# EasyEDA Pro project custom PCB June 25 2024.eprj

# Schematic Schematic1
Create Date: 2023-01-16; Page Name: P1; Project Name: Mine7; Schematic Name: Schematic1; Update Date: 2024-06-25; Company: AG6NS  Kazu Terasaki; Drawed: EasyEDA Pro; Page Size: A3; Part Number: JLCPCB-001; Reviewed: EasyEDA Pro; Version: 2023.09.11
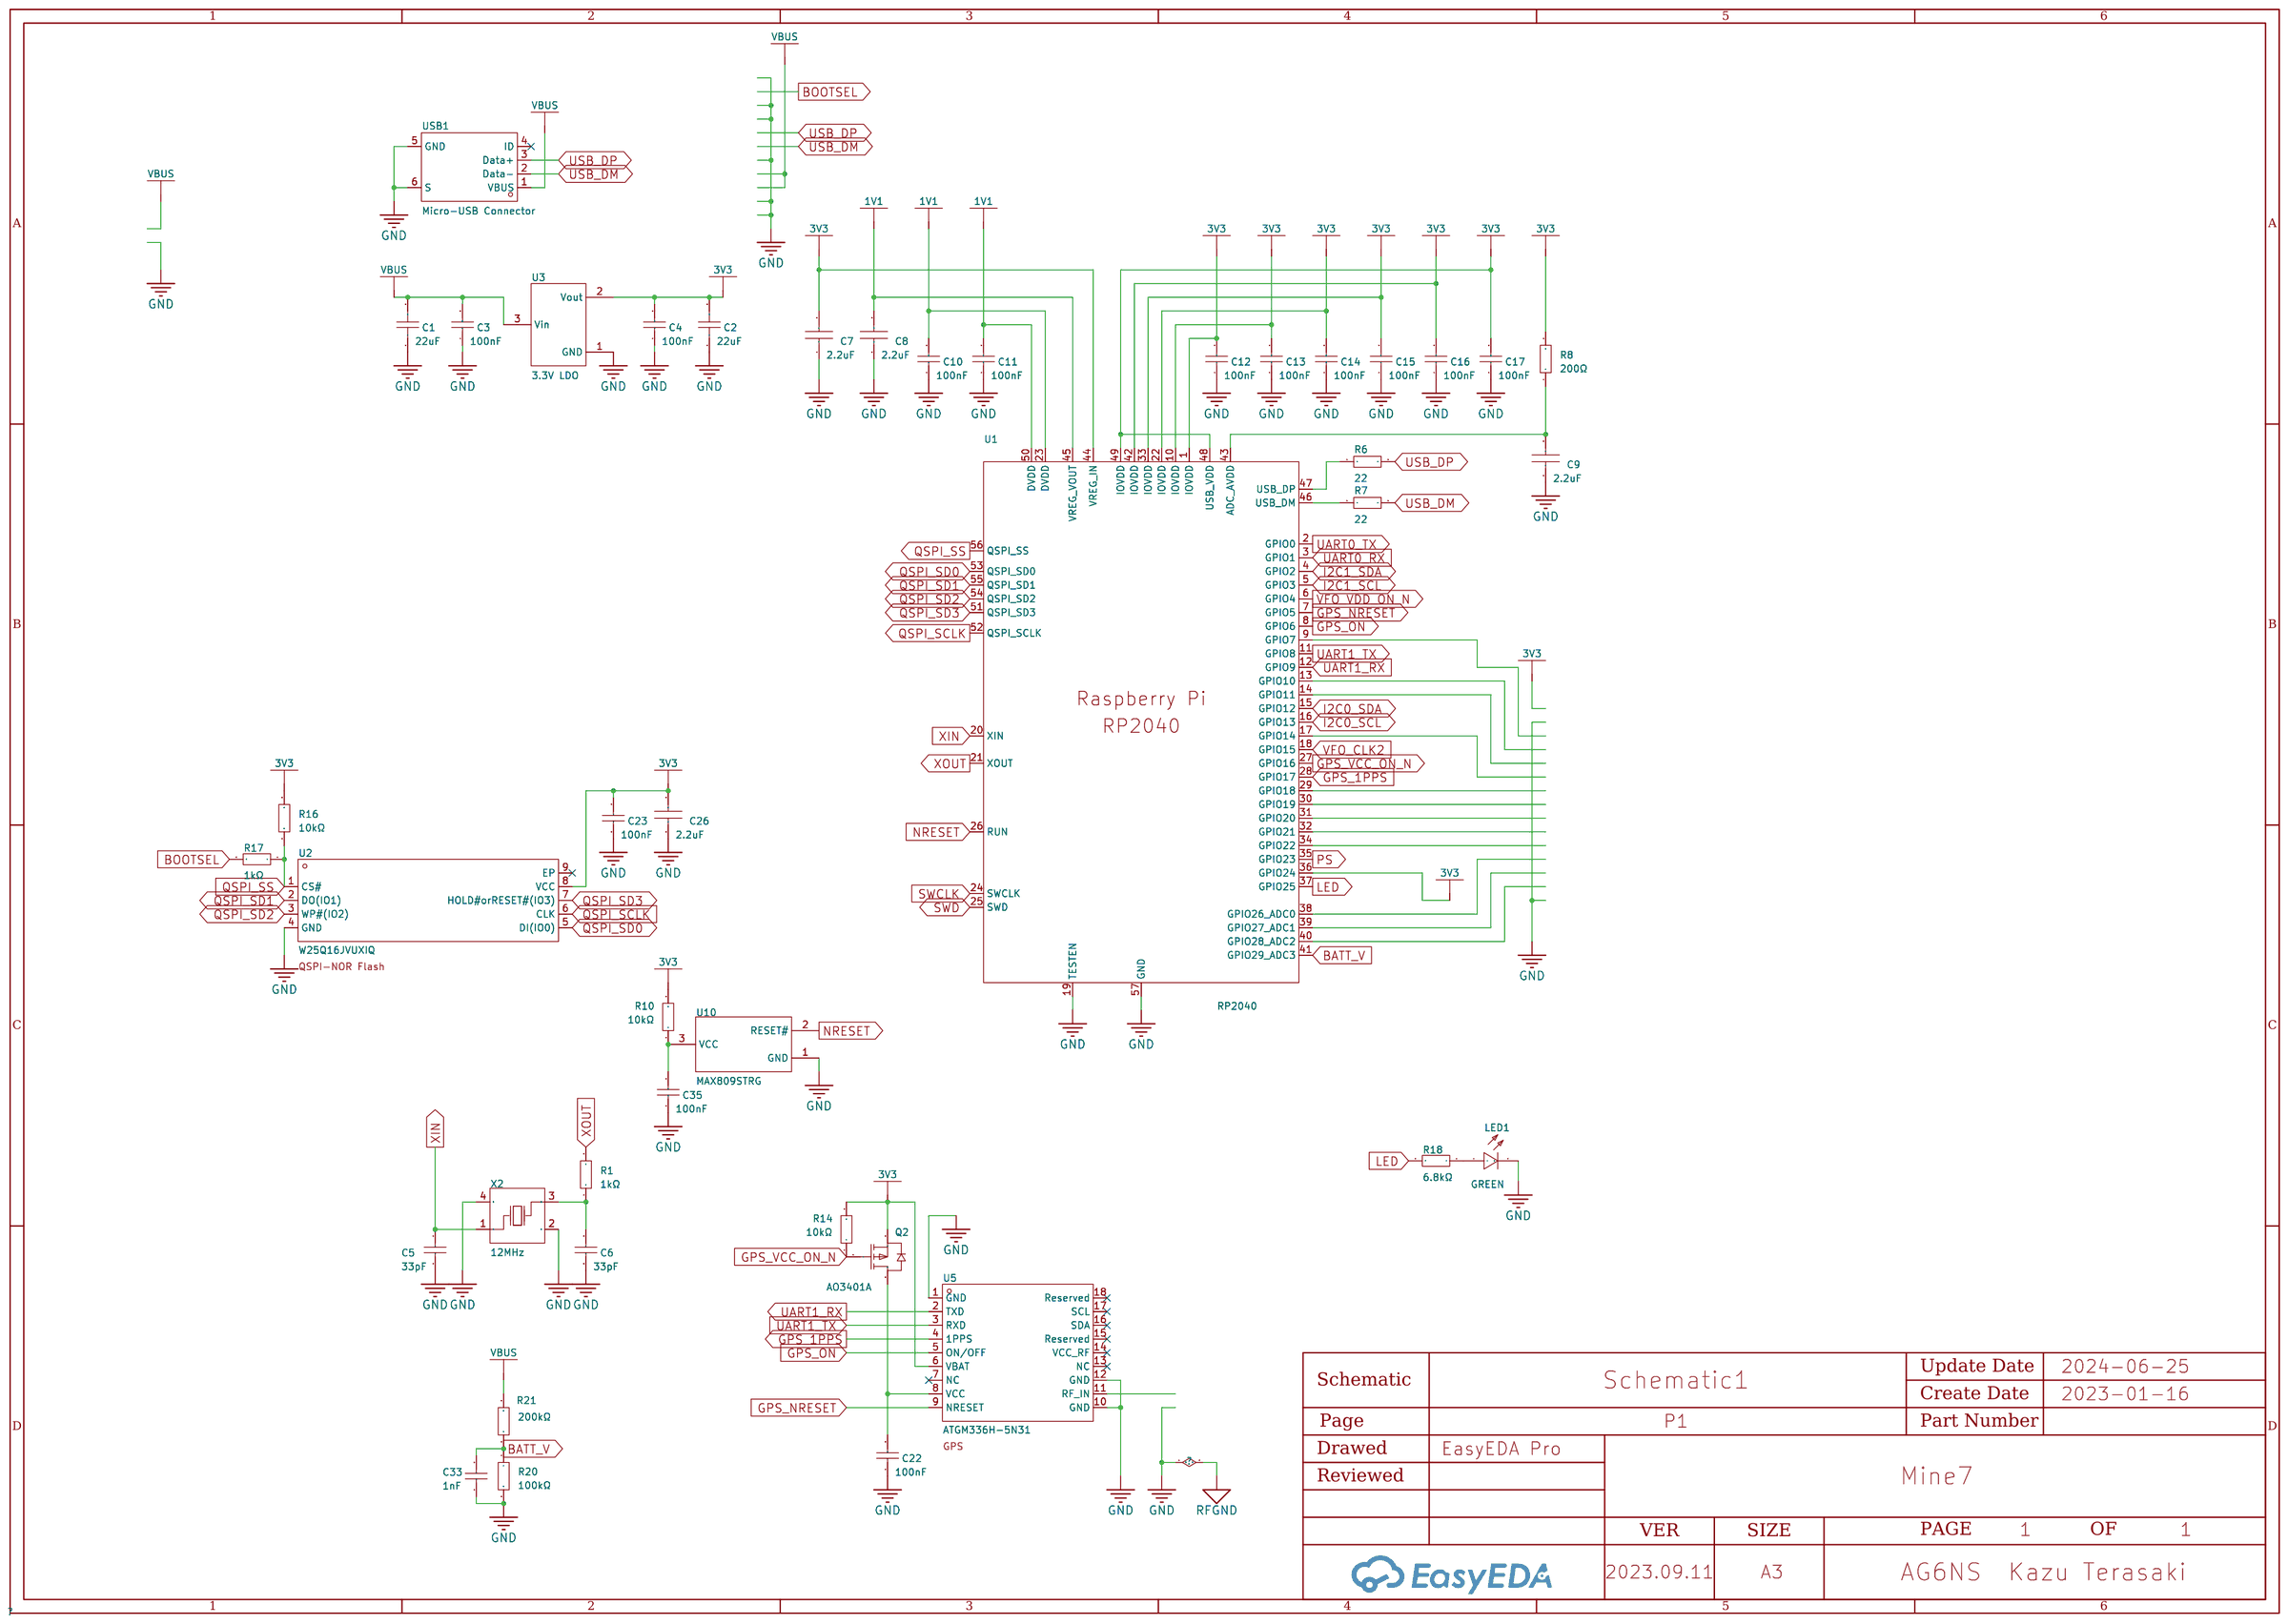
[diagram p0: schematic sheet]

## Parts
C1  22uF  [C0805]
C2  22uF  [C0603]
C3  100nF  [C0402_NEW]
C4  100nF  [C0402_NEW]
C5  33pF  [C0402]
C6  33pF  [C0402]
C7  2.2uF  [C0402]
C8  2.2uF  [C0402]
C9  2.2uF  [C0402]
C10  100nF  [C0402_NEW]
C11  100nF  [C0402_NEW]
C12  100nF  [C0402_NEW]
C13  100nF  [C0402_NEW]
C14  100nF  [C0402_NEW]
C15  100nF  [C0402_NEW]
C16  100nF  [C0402_NEW]
C17  100nF  [C0402_NEW]
C22  100nF  [C0402_NEW]
C23  100nF  [C0402_NEW]
C26  2.2uF  [C0402]
C33  1nF  [C0402]
C35  100nF  [C0402_NEW]
LED1  GREEN  [LED0603-R-RD]
Q2  AO3401A  [SOT-23_L2.9-W1.3-P1.90-LS2.4-BR]
R1  1kΩ  [R0402]
R6  22  [R0402]
R7  22  [R0402]
R8  200Ω  [R0402]
R10  10kΩ  [R0402]
R14  10kΩ  [R0402]
R16  10kΩ  [R0402]
R17  1kΩ  [R0402]
R18  6.8kΩ  [R0402]
R20  100kΩ  [R0402]
R21  200kΩ  [R0402]
U1  RP2040  [LQFN-56_L7.0-W7.0-P0.4-EP]
U2  W25Q16JVUXIQ  [USON-8_L3.0-W2.0-P0.50-BL-EP]
U3  3.3V LDO  [SOT-23-3_L2.9-W1.6-P1.90-LS2.8-BR]
U5  ATGM336H-5N31  [GPSM-SMD_ATGM336H-TR]
U10  MAX809STRG  [SOT-23-3_L2.9-W1.6-P1.90-LS2.8-BR]
USB1  Micro-USB Connector  [MICRO-USB-SMD_10118194-0001LF]
X2  12MHz  [OSC-SMD_4P-L3.2-W2.5-BL]

## Library data of the parts
C1 = CL21A226MAQNNNE_C45783: Capacitance: Tolerance:±20% Tolerance:±20% Voltage Rated: Temperature Coefficient:; LCSC Part Name: 22uF ±20% 25V; Supplier Part: C45783; Manufacturer: SAMSUNG(三星); Manufacturer Part: CL21A226MAQNNNE; Supplier Footprint: 0805; JLCPCB Part Class: Basic Part; Datasheet: https://atta.szlcsc.com/upload/public/pdf/source/20160103/1457707727161.pdf; Supplier: LCSC; Tolerance: ±20%
C2 = CL10A226MQ8NRNC: Capacitance: Tolerance:±20% Tolerance:±20% Voltage Rated: Temperature Coefficient:; LCSC Part Name: 22uF ±20% 6.3V; Supplier Part: C59461; Manufacturer: SAMSUNG(三星); Supplier Footprint: 0603; JLCPCB Part Class: Basic Part; Datasheet: https://atta.szlcsc.com/upload/public/pdf/source/20160103/1457707740762.pdf; Supplier: LCSC; Tolerance: ±20%
C3 C4 C10-C17 C22 C23 C35 = CL05B104KO5NNNC: Capacitance: Tolerance:±10% Tolerance:±10% Voltage Rated: Temperature Coefficient:; LCSC Part Name: 100nF ±10% 16V; Supplier Part: C1525; Manufacturer: SAMSUNG(三星); Supplier Footprint: 0402; JLCPCB Part Class: Basic Part; Datasheet: https://atta.szlcsc.com/upload/public/pdf/source/20160103/1457707674891.pdf; Supplier: LCSC; Tolerance: ±10%
C5 C6 = 0402CG330J500NT: Capacitance: Tolerance:±5% Tolerance:±5% Voltage Rated: Temperature Coefficient:; LCSC Part Name: 33pF ±5% 50V; Supplier Part: C1562; Manufacturer: FH(风华); Supplier Footprint: 0402; JLCPCB Part Class: Basic Part; Datasheet: https://atta.szlcsc.com/upload/public/pdf/source/20170923/C1562_1506149272462988369.pdf; Supplier: LCSC; Tolerance: ±5%
C7-C9 C26 = CL05A225MQ5NSNC: Capacitance: Tolerance:±20% Tolerance:±20% Voltage Rated: Temperature Coefficient:; LCSC Part Name: 2.2uF ±20% 6.3V; Supplier Part: C12530; Manufacturer: SAMSUNG(三星); Supplier Footprint: 0402; JLCPCB Part Class: Basic Part; Datasheet: https://atta.szlcsc.com/upload/public/pdf/source/20160103/1457707666860.pdf; Supplier: LCSC; Tolerance: ±20%
C33 = 0402B102K500NT: Capacitance: Tolerance:±10% Tolerance:±10% Voltage Rated: Temperature Coefficient:; LCSC Part Name: 1nF ±10% 50V; Supplier Part: C1523; Manufacturer: FH(风华); Supplier Footprint: 0402; JLCPCB Part Class: Basic Part; Datasheet: https://atta.szlcsc.com/upload/public/pdf/source/20170923/C1523_1506149254821988331.pdf; Supplier: LCSC; Tolerance: ±10%
LED1 = 19-217/GHC-YR1S2/3T: Emitted Color:Emerald Diode Configuration:- Lens Color:Colorless transparence Dominant Wavelength:520nm~535nm Dominant Wavelength:520nm~535nm Peak Wavelength:518nm Color Temperature:- Color Temperature:- Forward Current:20mA Power Dissipation:110mW Viewin; LCSC Part Name: 翠绿 520nm~535nm; Supplier Part: C72043; Manufacturer: EVERLIGHT(亿光); Supplier Footprint: 0603; JLCPCB Part Class: Basic Part; Datasheet: https://atta.szlcsc.com/upload/public/pdf/source/20160507/1462613613780.pdf; Supplier: LCSC; Emitted Color: Emerald; Lens Color: Colorless transparence; Dominant Wavelength: 520nm~535nm; Peak Wavelength: 518nm; Forward Current: 20mA; Power Dissipation: 110mW; Viewing Angle: 120°; Operating Temperature: -40~+85
Q2 = AO3401A_C15127: Type: Drain Source Voltage (Vdss): Continuous Drain Current (Id): Power Dissipation (Pd): Drain Source On Resistance (RDS(on)@Vgs,Id):44mΩ@10V,4.3A Gate Threshold Voltage (Vgs(th)@Id):1.3V@250uA; LCSC Part Name: P沟道 30V 4A; Supplier Part: C15127; Manufacturer: AOS; Supplier Footprint: SOT-23; JLCPCB Part Class: Basic Part; Datasheet: https://atta.szlcsc.com/upload/public/pdf/source/20160507/1462613609053.pdf; Supplier: LCSC; Drain Source On Resistance (RDS(on)@Vgs,Id): 44mΩ@10V,4.3A; Gate Threshold Voltage (Vgs(th)@Id): 1.3V@250uA
R1 R17 = 0402WGF1001TCE: Type:Thick Film Resistors Resistance: Tolerance:±1% Tolerance:±1% Power(Watts): Temperature Coefficient:±100ppm/ Temperature Coefficient:±100ppm/ Overload Voltage (Max): Operating Temperature Range:-55~+155 Operating Temperature Range:-55~+155; LCSC Part Name: 1kΩ ±1% 62.5mW; Supplier Part: C11702; Manufacturer: UNI-ROYAL(厚声); Supplier Footprint: 0402; JLCPCB Part Class: Basic Part; Datasheet: https://atta.szlcsc.com/upload/public/pdf/source/20200306/C422600_1E6D84923E4A46A82E41ADD87F860B5C.pdf; Supplier: LCSC; Type: Thick Film Resistors; Tolerance: ±1%; Temperature Coefficient: ±100ppm/; Operating Temperature Range: -55~+155
R6 R7 = 0402WGF220JTCE: LCSC Part Name: 22Ω(22R0) ±1% 编带; Supplier Part: C25092; Manufacturer: UNI-ROYAL(厚声); Supplier Footprint: 0402; JLCPCB Part Class: Basic Part; Datasheet: https://atta.szlcsc.com/upload/public/pdf/source/20170920/C25092_1505901206069982723.pdf; Supplier: LCSC
R8 = 0402WGF2000TCE: Type:Thick Film Resistors Resistance: Tolerance:±1% Tolerance:±1% Power(Watts): Temperature Coefficient:±100ppm/ Temperature Coefficient:±100ppm/ Overload Voltage (Max): Operating Temperature Range:-55~+155 Operating Temperature Range:-55~+155; LCSC Part Name: 200Ω ±1% 62.5mW; Supplier Part: C25087; Manufacturer: UNI-ROYAL(厚声); Supplier Footprint: 0402; JLCPCB Part Class: Basic Part; Datasheet: https://atta.szlcsc.com/upload/public/pdf/source/20200306/C422600_1E6D84923E4A46A82E41ADD87F860B5C.pdf; Supplier: LCSC; Type: Thick Film Resistors; Tolerance: ±1%; Temperature Coefficient: ±100ppm/; Operating Temperature Range: -55~+155
R10 R14 R16 = 0402WGF1002TCE: Type:Thick Film Resistors Resistance: Tolerance:±1% Tolerance:±1% Power(Watts): Temperature Coefficient:±100ppm/ Temperature Coefficient:±100ppm/ Overload Voltage (Max): Operating Temperature Range:-55~+155 Operating Temperature Range:-55~+155; LCSC Part Name: 10kΩ ±1% 62.5mW; Supplier Part: C25744; Manufacturer: UNI-ROYAL(厚声); Supplier Footprint: 0402; JLCPCB Part Class: Basic Part; Datasheet: https://atta.szlcsc.com/upload/public/pdf/source/20200306/C422600_1E6D84923E4A46A82E41ADD87F860B5C.pdf; Supplier: LCSC; Type: Thick Film Resistors; Tolerance: ±1%; Temperature Coefficient: ±100ppm/; Operating Temperature Range: -55~+155
R18 = 0402WGF6801TCE: Type:Thick Film Resistors Resistance: Tolerance:±1% Tolerance:±1% Power(Watts): Temperature Coefficient:±100ppm/ Temperature Coefficient:±100ppm/ Overload Voltage (Max): Operating Temperature Range:-55~+155 Operating Temperature Range:-55~+155; LCSC Part Name: 6.8kΩ ±1% 62.5mW; Supplier Part: C25917; Manufacturer: UNI-ROYAL(厚声); Supplier Footprint: 0402; JLCPCB Part Class: Basic Part; Datasheet: https://atta.szlcsc.com/upload/public/pdf/source/20200306/C422600_1E6D84923E4A46A82E41ADD87F860B5C.pdf; Supplier: LCSC; Type: Thick Film Resistors; Tolerance: ±1%; Temperature Coefficient: ±100ppm/; Operating Temperature Range: -55~+155
R20 = 0402WGF1003TCE: Type:Thick Film Resistors Resistance: Tolerance:±1% Tolerance:±1% Power(Watts): Temperature Coefficient:±100ppm/ Temperature Coefficient:±100ppm/ Overload Voltage (Max): Operating Temperature Range:-55~+155 Operating Temperature Range:-55~+155; LCSC Part Name: 100kΩ ±1% 62.5mW; Supplier Part: C25741; Manufacturer: UNI-ROYAL(厚声); Supplier Footprint: 0402; JLCPCB Part Class: Basic Part; Datasheet: https://atta.szlcsc.com/upload/public/pdf/source/20200306/C422600_1E6D84923E4A46A82E41ADD87F860B5C.pdf; Supplier: LCSC; Type: Thick Film Resistors; Tolerance: ±1%; Temperature Coefficient: ±100ppm/; Operating Temperature Range: -55~+155
R21 = 0402WGF2003TCE: Resistance: Tolerance: Power(Watts): Temperature Coefficient: Temperature Coefficient: Overload Voltage (Max): Operating Temperature Range: Operating Temperature Range:; LCSC Part Name: 200KΩ ±1%; Supplier Part: C25764; Manufacturer: UNI-ROYAL(厚声); Supplier Footprint: 0402; JLCPCB Part Class: Basic Part; Datasheet: https://atta.szlcsc.com/upload/public/pdf/source/20170920/C25764_1505901532268983339.pdf; Supplier: LCSC
U1 = RP2040_C2040: CPU Core:ARM Cortex-M0 Maximum Frequency:133MHz Supply Voltage Range:- Supply Voltage Range:- Internal Oscillator:- External Clock Frequency Rang:- External Clock Frequency Rang:- Program FLASH Size:- RAM Size:264KB EEPROM/Data FLASH Size:- GPIO Ports Num; LCSC Part Name: ARM Cortex-M0 133MHz RAM：264KB; Supplier Part: C2040; Manufacturer: Raspberry Pi(树莓派); Supplier Footprint: LQFN-56(7x7); JLCPCB Part Class: Extended Part; Datasheet: https://atta.szlcsc.com/upload/public/pdf/source/20210621/C2040_96F425825606B7957D87DD32E2512CA9.pdf; Supplier: LCSC; CPU Core: ARM Cortex-M0; Maximum Frequency: 133MHz; RAM Size: 264KB; GPIO Ports Number: 30; ADC (Units/Channels/bits): 1@x4ch/12bit; U(S)ART Number: 2; I2C Number: 2; (Q)SPI Number: 2; USB (H/D/OTG): USB Host/Device; Peripherals / Functions / Protocol Stacks: DMA；PWM
U2 = W25Q16JVUXIQ: QSPI-NOR Flash; Supplier Part: C2843335; Manufacturer: WINBOND(华邦); Supplier Footprint: USON-8; JLCPCB Part Class: Extended Part; Datasheet: https://atta.szlcsc.com/upload/public/pdf/source/20210629/C2843335_FB4D78B5076715625DC0C83F790D3044.pdf; Supplier: LCSC
U3 = XC6206P332MR_C5446: Output Type: Output Polarity:Positive Number of Outputs:1 Maximum Input Voltage:6V Output Voltage:3.3V~3.3V Output Voltage:3.3V~3.3V Dropout Voltage:680mV@(100mA) Output Current:200mA Power Supply Rejection Ratio (PSRR):-; LCSC Part Name: 正 Vin=6V Vout=3.3V 200mA; Supplier Part: C5446; Manufacturer: TOREX(特瑞仕); Manufacturer Part: XC6206P332MR; Supplier Footprint: SOT-23; JLCPCB Part Class: Basic Part; Datasheet: https://atta.szlcsc.com/upload/public/pdf/source/20130801/1457706628791.pdf; Supplier: LCSC; Output Polarity: Positive; Number of Outputs: 1; Maximum Input Voltage: 6V; Output Voltage: 3.3V~3.3V; Dropout Voltage: 680mV@(100mA); Output Current: 200mA
U5 = ATGM336H-5N31: GPS; Supplier Part: C90770; Manufacturer: 杭州中科微; Supplier Footprint: 9.7x10.1mm; JLCPCB Part Class: Extended Part; Datasheet: https://atta.szlcsc.com/upload/public/pdf/source/20161226/1482720799860.pdf; Supplier: LCSC
U10 = MAX809STRG: Output Type:推挽 Reset Active Level:低电平有效 Number of Voltages Monitored:1 Threshold Voltage:2.93V Reset Timeout:140ms Operating Temperature:-40~+105@(TJ) Operating Temperature:-40~+105@(TJ) Type of the Power Management Chip:Simple reset/Power-on reset; LCSC Part Name: Voltage Supervisor, Very Low Supply Current, 3-Pin Microprocessor, Reset Monitor; Supplier Part: C9965; Manufacturer: onsemi(安森美); Supplier Footprint: SOT-23; JLCPCB Part Class: Extended Part; Datasheet: https://atta.szlcsc.com/upload/public/pdf/source/20170918/C9965_1505727085373976535.PDF; Supplier: LCSC; Output Type: 推挽; Reset Active Level: 低电平有效; Number of Voltages Monitored: 1; Threshold Voltage: 2.93V; Reset Timeout: 140ms; Operating Temperature: -40~+105@(TJ); Type of the Power Management Chip: Simple reset/Power-on reset
USB1 = 10118194-0001LF: Connector Type:Micro-B Standard:USB 2.0 Gender:Female Number of Contacts:5 Number of Ports:1; LCSC Part Name: Micro-B 母座; Supplier Part: C132563; Manufacturer: Amphenol; Supplier Footprint: SMD; JLCPCB Part Class: Extended Part; Datasheet: https://atta.szlcsc.com/upload/public/pdf/source/20210630/C132563_323781699BE9D7BFAD8DF70EA5820798.pdf; Supplier: LCSC; Connector Type: Micro-B; Standard: USB 2.0; Gender: Female; Number of Contacts: 5; Number of Ports: 1
X2 = X322512MSB4SI: Crystal Type:SMD Crystal Resonator Frequency: Frequency Tolerance:±10ppm Frequency Tolerance:±10ppm Frequency Stability:±30ppm Frequency Stability:±30ppm Load Capacitance: Operating Temperature: Operating Temperature:; LCSC Part Name: 12MHz ±10ppm 20pF; Supplier Part: C9002; Manufacturer: YXC(扬兴晶振); Supplier Footprint: SMD3225-4P; JLCPCB Part Class: Basic Part; Datasheet: https://atta.szlcsc.com/upload/public/pdf/source/20210329/C112971_1F611BDC486E193C1706F6D8EB5AA189.pdf; Supplier: LCSC; Crystal Type: SMD Crystal Resonator; Frequency Tolerance: ±10ppm; Frequency Stability: ±30ppm

## Nets
1V1: C8.2 C10.2 C11.2 U1.23(DVDD) U1.45(VREG_VOUT) U1.50(DVDD)
3V3: C2.2 C4.2 C7.2 C12.2 C13.2 C14.2 C15.2 C16.2 C17.2 C23.2 C26.2 Q2.2(S) R8.2 R10.2 R14.2 R16.2 U1.1(IOVDD) U1.10(IOVDD) U1.22(IOVDD) U1.33(IOVDD) U1.36(GPIO24) U1.42(IOVDD) U1.44(VREG_IN) U1.48(USB_VDD) U1.49(IOVDD) U2.8(VCC) U3.2(Vout) U5.6(VBAT)
GND: C1.1 C2.1 C3.1 C4.1 C5.1 C6.1 C7.1 C8.1 C9.1 C10.1 C11.1 C12.1 C13.1 C14.1 C15.1 C16.1 C17.1 C22.1 C23.1 C26.1 C33.1 C35.1 LED1.2(C) R20.2 U1.19(TESTEN) U1.57(GND) U2.4(GND) U3.1(GND) U5.1(GND) U5.10(GND) U5.12(GND) U10.1(GND) USB1.5(GND) USB1.6(S) X2.2(GND) X2.4(GND)
VBUS: C1.2 C3.2 R21.2 U3.3(Vin) USB1.1(VBUS)
ADC0: U1.38(GPIO26_ADC0)
ADC1: U1.39(GPIO27_ADC1)
ADC2: U1.40(GPIO28_ADC2)
ADC_AVDD: C9.2 R8.1 U1.43(ADC_AVDD)
BATT_V: C33.2 R20.1 R21.1 U1.41(GPIO29_ADC3)
BOOTSEL: R17.2
GPIO7: U1.9(GPIO7)
GPIO10: U1.13(GPIO10)
GPIO11: U1.14(GPIO11)
GPIO14: U1.17(GPIO14)
GPIO18: U1.29(GPIO18)
GPIO19: U1.30(GPIO19)
GPIO20: U1.31(GPIO20)
GPIO21: U1.32(GPIO21)
GPIO22: U1.34(GPIO22)
GPS_1PPS: U1.28(GPIO17) U5.4(1PPS)
GPS_3V3: C22.2 Q2.3(D) U5.8(VCC)
GPS_ANT: U5.11(RF_IN)
GPS_NRESET: U1.7(GPIO5) U5.9(NRESET)
GPS_ON: U1.8(GPIO6) U5.5(ON/OFF)
GPS_VCC_ON_N: Q2.1(G) R14.1 U1.27(GPIO16)
I2C0_SCL: U1.16(GPIO13)
I2C0_SDA: U1.15(GPIO12)
I2C1_SCL: U1.5(GPIO3)
I2C1_SDA: U1.4(GPIO2)
LED: R18.2 U1.37(GPIO25)
NRESET: U1.26(RUN) U10.2(RESET#)
PS: U1.35(GPIO23)
QSPI_SCLK: U1.52(QSPI_SCLK) U2.6(CLK)
QSPI_SD0: U1.53(QSPI_SD0) U2.5(DI(IO0))
QSPI_SD1: U1.55(QSPI_SD1) U2.2(DO(IO1))
QSPI_SD2: U1.54(QSPI_SD2) U2.3(WP#(IO2))
QSPI_SD3: U1.51(QSPI_SD3) U2.7(HOLD#orRESET#(IO3))
QSPI_SS: R16.1 R17.1 U1.56(QSPI_SS) U2.1(CS#)
SWCLK: U1.24(SWCLK)
SWD: U1.25(SWD)
UART0_RX: U1.3(GPIO1)
UART0_TX: U1.2(GPIO0)
UART1_RX: U1.12(GPIO9) U5.2(TXD)
UART1_TX: U1.11(GPIO8) U5.3(RXD)
USB_DM: R7.2 USB1.2(Data-)
USB_DP: R6.2 USB1.3(Data+)
VFO_CLK2: U1.18(GPIO15)
VFO_VDD_ON_N: U1.6(GPIO4)
XIN: C5.2 U1.20(XIN) X2.1(OSC1)
XOUT: R1.2 U1.21(XOUT)
$1N22007: R7.1 U1.46(USB_DM)
$1N22362: R6.1 U1.47(USB_DP)
$1N70752: C6.2 R1.1 X2.3(OSC2)
$1N107124: LED1.1(A) R18.1
$1N115739: C35.2 R10.1 U10.3(VCC)

Not connected (* = marked no-connect by the designer): U2 9(EP)*; U5 7(NC)* 13(NC)* 14(VCC_RF)* 15(Reserved)* 16(SDA)* 17(SCL)* 18(Reserved)*; USB1 4(ID)*

# Board PCB1
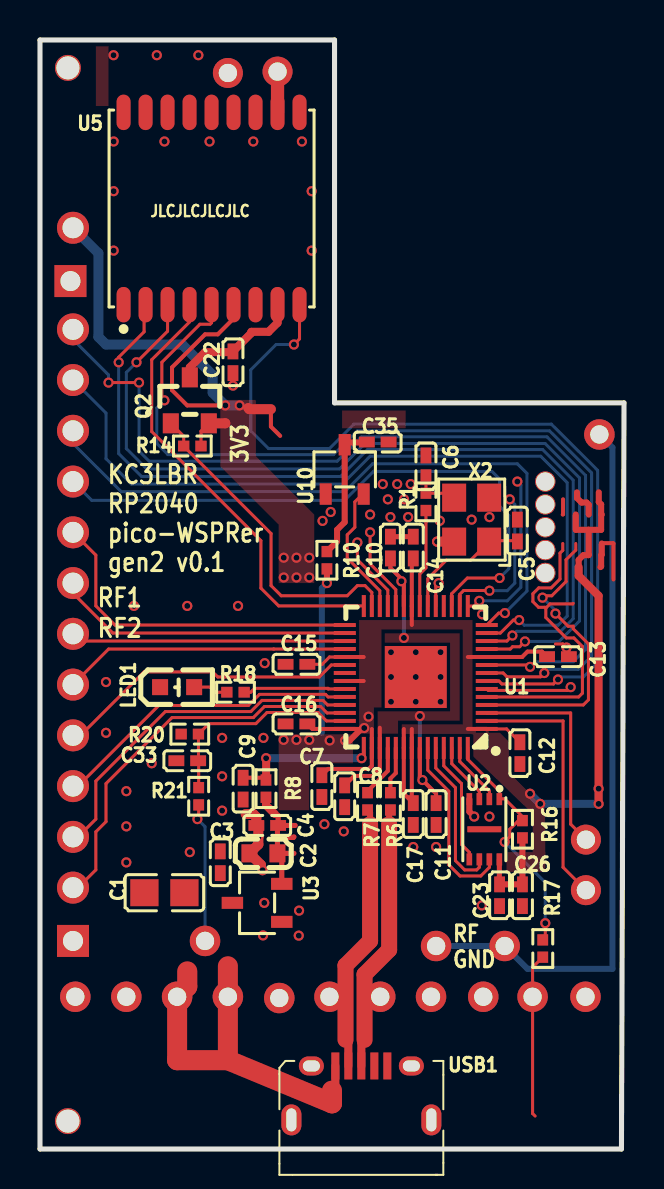
[diagram p1: board, top side]
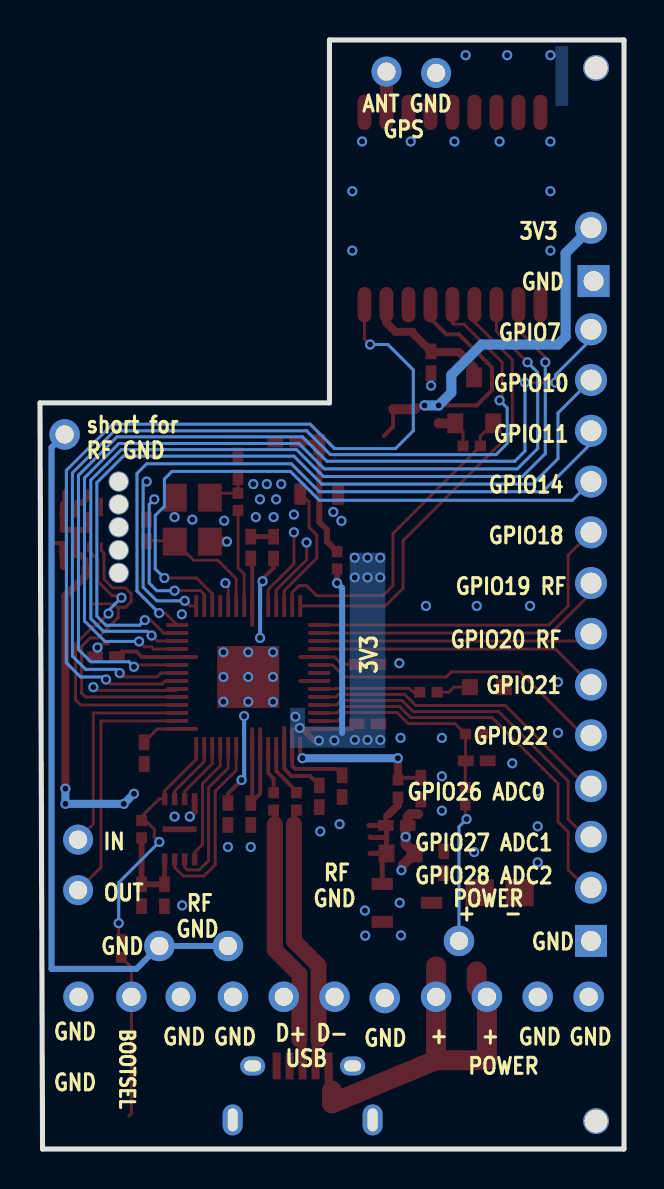
[diagram p2: board, bottom side, seen from below]

Outline 29.21 x 55.5 mm; copper layers: Top Layer, Bottom Layer. Coordinates in mm from the lower left corner of the outline.
Outline path: 0,55.5 0,0 29.08,0 29.21,37.34 14.73,37.34 14.73,55.5 0,55.5
Stack: Top Layer 0.035mm / Dielectric1 1.51mm FR4 er 4.5 / Bottom Layer 0.035mm

## Design rules (mm)
spacing safeClearance (default): track to track 0.152, other pairs 0.152 to 0.3
track width trackWidth (default): min 0.127, default 0.254, max 2.54
differential pair differentialPair (default): width min 0.127, default 0.254, max 2.54; gap min 0.152, default 0.152
via viaSize (default): diameter min 0.5, default 0.61, max 10; hole min 0.3, default 0.305, max 6

## Placement (name value [footprint] x y rotation side)
C1  22uF  [C0805]  6.22 12.83 0 top
C2  22uF  [C0603]  11.18 14.8 0 top
C3  100nF  [C0402_NEW]  9.02 14.35 270 top
C4  100nF  [C0402_NEW]  11.37 16.19 0 top
C5  33pF  [C0402]  23.88 30.95 270 top
C6  33pF  [C0402]  19.3 34.16 270 top
C7  2.2uF  [C0402]  14.1 18.16 90 top
C8  2.2uF  [C0402]  15.24 17.65 90 top
C9  2.2uF  [C0402]  10.16 18.03 90 top
C10  100nF  [C0402_NEW]  17.53 30.1 270 top
C11  100nF  [C0402_NEW]  19.81 16.76 90 top
C12  100nF  [C0402_NEW]  24 19.81 90 top
C13  100nF  [C0402_NEW]  25.91 24.64 180 top
C14  100nF  [C0402_NEW]  18.67 30.1 270 top
C15  100nF  [C0402_NEW]  12.83 24.26 0 top
C16  100nF  [C0402_NEW]  12.83 21.27 0 top
C17  100nF  [C0402_NEW]  18.67 16.76 90 top
C22  100nF  [C0402_NEW]  9.65 39.37 90 top
C23  100nF  [C0402_NEW]  22.99 12.7 90 top
C26  2.2uF  [C0402]  24.13 12.7 90 top
C33  1nF  [C0402]  7.37 19.43 0 top
C35  100nF  [C0402_NEW]  16.89 35.38 180 top
LED1  GREEN  [LED0603-R-RD]  6.86 23.11 0 top
NOREF  -  [Pad_e65]  14.48 7.62 0 top
NOREF#2  -  [Pad_e61]  4.32 7.62 0 top
NOREF#3  -  [Pad_e43]  1.65 35.94 0 top
NOREF#4  -  [Pad_e30]  1.65 18.16 0 top
NOREF#5  -  [Pad_e54]  24.64 7.62 0 top
NOREF#6  -  [Pad_e568]  11.88 53.92 0 top
NOREF#7  -  [Pad_e62]  6.86 7.62 0 top
NOREF#8  -  [Pad_e13209]  25.27 32.26 0 top
NOREF#9  -  [Pad_e32]  1.65 23.24 0 top
NOREF#10  -  [Pad_e68]  22.17 7.62 0 top
NOREF#11  -  [Pad_e66]  17.02 7.62 0 top
NOREF#12  -  [Pad_e25]  1.65 15.62 0 top
NOREF#13  -  [Pad_e566]  9.4 53.85 0 top
NOREF#14  -  [Pad_e64]  11.97 7.56 0 top
NOREF#15  -  [Pad_e33]  1.65 25.78 0 top
NOREF#16  -  [Pad_e63]  9.4 7.62 0 top
NOREF#17  -  [Pad_e20]  1.52 43.43 0 top
NOREF#18  -  [Pad_e4428]  23.24 10.16 0 top
NOREF#19  -  [Pad_e12433]  25.27 33.4 0 top
NOREF#20  -  [Pad_e19]  1.65 10.41 0 top
NOREF#21  -  [Pad_e22]  27.31 12.95 0 top
NOREF#22  -  [Pad_e5896]  1.4 54.1 0 top
NOREF#23  -  [Pad_e9054]  19.81 10.16 0 top
NOREF#24  -  [Pad_e45]  1.65 41.02 0 top
NOREF#25  -  [Pad_e35]  1.65 28.32 0 top
NOREF#26  -  [Pad_e13408]  25.27 31.12 0 top
NOREF#27  -  [Pad_e31]  1.65 20.7 0 top
NOREF#28  -  [Pad_e72]  8.25 10.41 0 top
NOREF#29  -  [Pad_e44]  1.65 38.48 0 top
NOREF#30  -  [Pad_e5590]  1.4 1.4 0 top
NOREF#31  -  [Pad_e18196]  25.27 28.83 0 top
NOREF#32  -  [Pad_e13409]  25.27 29.97 0 top
NOREF#33  -  [Pad_e19751]  27.98 35.76 0 top
NOREF#34  -  [Pad_e46]  1.65 46.1 0 top
NOREF#35  -  [Pad_e60]  1.77 7.62 0 top
NOREF#36  -  [Pad_e69]  27.28 7.62 0 top
NOREF#37  -  [Pad_e26]  27.31 15.48 0 top
NOREF#38  -  [Pad_e67]  19.56 7.62 0 top
NOREF#39  -  [Pad_e36]  1.65 30.86 0 top
NOREF#40  -  [Pad_e37]  1.65 33.4 0 top
NOREF#41  -  [Pad_e21]  1.65 13.08 0 top
Q2  AO3401A  [SOT-23_L2.9-W1.3-P1.90-LS2.4-BR]  7.49 37.47 270 top
R1  1kΩ  [R0402]  19.3 32.39 270 top
R6  22  [R0402]  17.53 17.4 270 top
R7  22  [R0402]  16.38 17.4 270 top
R8  200Ω  [R0402]  11.3 18.03 270 top
R10  10kΩ  [R0402]  14.35 29.46 270 top
R14  10kΩ  [R0402]  7.62 35.18 0 top
R16  10kΩ  [R0402]  24.13 16 270 top
R17  1kΩ  [R0402]  25.15 10.03 270 top
R18  6.8kΩ  [R0402]  9.78 22.86 0 top
R20  100kΩ  [R0402]  7.49 20.76 180 top
R21  200kΩ  [R0402]  7.94 17.65 270 top
U1  RP2040  [LQFN-56_L7.0-W7.0-P0.4-EP]  18.8 23.62 180 top
U2  W25Q16JVUXIQ  [USON-8_L3.0-W2.0-P0.50-BL-EP]  22.22 16 180 top
U3  3.3V LDO  [SOT-23-3_L2.9-W1.6-P1.90-LS2.8-BR]  10.86 12.32 0 top
U5  ATGM336H-5N31  [GPSM-SMD_ATGM336H-TR]  8.58 47.07 180 top
U10  MAX809STRG  [SOT-23-3_L2.9-W1.6-P1.90-LS2.8-BR]  15.24 34.01 270 top
USB1  Micro-USB Connector  [MICRO-USB-SMD_10118194-0001LF]  16.07 2.81 0 top
X2  12MHz  [OSC-SMD_4P-L3.2-W2.5-BL]  21.59 31.5 90 top

## Footprints (pads in the part's own frame, mm; a bottom-side part is the same pattern mirrored in y, then rotated)
C0402
  rect 0.79x0.54 smd: 1(-0.545,0) 2(0.545,0)
C0402_NEW
  rect 0.79x0.54 smd: 1(-0.545,0) 2(0.545,0)
C0603
  rect 0.8x0.9 smd: 1(-0.7,0) 2(0.7,0)
C0805
  rect 1.41x1.35 smd: 1(-1,0) 2(1,0)
GPSM-SMD_ATGM336H-TR
  oval 0.7x1.773 smd: 1(4.4,4.811) 2(3.3,4.811) 3(2.2,4.811) 4(1.1,4.811) 5(0,4.811) 6(-1.1,4.811) 7(-2.2,4.811) 8(-3.3,4.811) 9(-4.4,4.811) 10(-4.4,-4.811) 11(-3.3,-4.811) 12(-2.2,-4.811) 13(-1.1,-4.811) 14(0,-4.811) 15(1.1,-4.811) 16(2.2,-4.811) 17(3.3,-4.811) 18(4.4,-4.811)
LED0603-R-RD
  rect 0.8x0.8 smd: 1(0.851,0) 2(-0.851,0)
LQFN-56_L7.0-W7.0-P0.4-EP
  rect 1.1x0.2 smd: 1(-3.55,2.6) 2(-3.55,2.2) 3(-3.55,1.8) 4(-3.55,1.4) 5(-3.55,1) 6(-3.55,0.6) 7(-3.55,0.2) 8(-3.55,-0.2) 9(-3.55,-0.6) 10(-3.55,-1) 11(-3.55,-1.4) 12(-3.55,-1.8) 13(-3.55,-2.2) 14(-3.55,-2.6) 29(3.55,-2.6) 30(3.55,-2.2) 31(3.55,-1.8) 32(3.55,-1.4) 33(3.55,-1) 34(3.55,-0.6) 35(3.55,-0.2) 36(3.55,0.2) 37(3.55,0.6) 38(3.55,1) 39(3.55,1.4) 40(3.55,1.8) 41(3.55,2.2) 42(3.55,2.6)
  rect 0.2x1.1 smd: 15(-2.6,-3.55) 16(-2.2,-3.55) 17(-1.8,-3.55) 18(-1.4,-3.55) 19(-1,-3.55) 20(-0.6,-3.55) 21(-0.2,-3.55) 22(0.2,-3.55) 23(0.6,-3.55) 24(1,-3.55) 25(1.4,-3.55) 26(1.8,-3.55) 27(2.2,-3.55) 28(2.6,-3.55) 43(2.6,3.55) 44(2.2,3.55) 45(1.8,3.55) 46(1.4,3.55) 47(1,3.55) 48(0.6,3.55) 49(0.2,3.55) 50(-0.2,3.55) 51(-0.6,3.55) 52(-1,3.55) 53(-1.4,3.55) 54(-1.8,3.55) 55(-2.2,3.55) 56(-2.6,3.55)
  rect 3.1x3.1 smd: 57(0,0)
MICRO-USB-SMD_10118194-0001LF
  rect 0.4x1.35 smd: 1(-1.3,1.35) 2(-0.65,1.35) 3(0,1.35) 4(0.65,1.35) 5(1.3,1.35)
  oval 1x1.55 hole 0.5x1.15: 6(-3.5,-1.35) 6(3.5,-1.35)
  oval 1.25x0.95 hole 0.85x0.55: 6(-2.5,1.35) 6(2.5,1.35)
OSC-SMD_4P-L3.2-W2.5-BL
  rect 1.4x1.2 smd: 1(-1.1,-0.875) 2(1.1,-0.875) 3(1.1,0.875) 4(-1.1,0.875)
Pad_e19
  rect 1.6x1.6 hole 1: 7(0,0)
Pad_e20
  rect 1.6x1.6 hole 1: 9(0,0)
Pad_e21
  round 1.6 hole 1.05: 9(0,0)
Pad_e22
  round 1.5 hole 0.914: 1(0,0)
Pad_e25
  round 1.6 hole 1.05: 10(0,0)
Pad_e26
  round 1.5 hole 0.914: 2(0,0)
Pad_e30
  round 1.6 hole 1.05: 11(0,0)
Pad_e31
  round 1.6 hole 1.05: 12(0,0)
Pad_e32
  round 1.6 hole 1.05: 13(0,0)
Pad_e33
  round 1.6 hole 1.05: 14(0,0)
Pad_e35
  round 1.6 hole 1.05: 15(0,0)
Pad_e36
  round 1.6 hole 1.05: 16(0,0)
Pad_e37
  round 1.6 hole 1.05: 17(0,0)
Pad_e43
  round 1.6 hole 1.05: 18(0,0)
Pad_e44
  round 1.6 hole 1.05: 31(0,0)
Pad_e45
  round 1.6 hole 1.05: 45(0,0)
Pad_e46
  round 1.6 hole 1.05: 60(0,0)
Pad_e54
  round 1.524 hole 0.914: 17(0,0)
Pad_e60
  round 1.524 hole 0.914: 34(0,0)
Pad_e61
  round 1.524 hole 0.914: 52(0,0)
Pad_e62
  round 1.524 hole 0.914: 71(0,0)
Pad_e63
  round 1.524 hole 0.914: 72(0,0)
Pad_e64
  round 1.524 hole 0.914: 73(0,0)
Pad_e65
  round 1.524 hole 0.914: 74(0,0)
Pad_e66
  round 1.524 hole 0.914: 75(0,0)
Pad_e67
  round 1.524 hole 0.914: 76(0,0)
Pad_e68
  round 1.524 hole 0.914: 77(0,0)
Pad_e69
  round 1.524 hole 0.914: 78(0,0)
Pad_e72
  round 1.524 hole 0.914: 98(0,0)
Pad_e566
  round 1.5 hole 0.914: 2(0,0)
Pad_e568
  round 1.5 hole 0.914: 4(0,0)
Pad_e4428
  round 1.524 hole 0.914: 1(0,0)
Pad_e5590
  round 1.3 hole 1.152: 3(0,0)
Pad_e5896
  round 1.3 hole 1.152: 1(0,0)
Pad_e9054
  round 1.524 hole 0.914: 5(0,0)
Pad_e12433
  round 1.016 hole 0.914: 0(0,0)
Pad_e13209
  round 1.016 hole 0.914: 0(0,0)
Pad_e13408
  round 1.016 hole 0.914: 0(0,0)
Pad_e13409
  round 1.016 hole 0.914: 0(0,0)
Pad_e18196
  round 1.016 hole 0.914: 0(0,0)
Pad_e19751
  round 1.524 hole 0.914: 2(0,0)
R0402
  rect 0.566x0.54 smd: 1(-0.433,0) 2(0.433,0)
SOT-23-3_L2.9-W1.6-P1.90-LS2.8-BR
  rect 1.07x0.6 smd: 1(1.235,-0.95) 2(1.235,0.95) 3(-1.235,0)
SOT-23_L2.9-W1.3-P1.90-LS2.4-BR
  rect 1x0.8 smd: 1(1.15,-0.95) 2(1.15,0.95) 3(-1.15,0)
USON-8_L3.0-W2.0-P0.50-BL-EP
  rect 0.28x0.6 smd: 1(-0.75,-1.508) 2(-0.25,-1.508) 3(0.25,-1.508) 4(0.75,-1.508) 5(0.75,1.508) 6(0.25,1.508) 7(-0.25,1.508) 8(-0.75,1.508)
  rect 1.7x0.3 smd: 9(0,0)

## Nets
1V1: C8.2 C10.2 C11.2 U1.23 U1.45 U1.50
3V3: C2.2 C4.2 C7.2 C12.2 C13.2 C14.2 C15.2 C16.2 C17.2 C23.2 C26.2 NOREF#34.60 Q2.2 R8.2 R10.2 R14.2 R16.2 U1.1 U1.10 U1.22 U1.33 U1.36 U1.42 U1.44 U1.48 U1.49 U2.8 U3.2 U5.6
GND: C1.1 C2.1 C3.1 C4.1 C5.1 C6.1 C7.1 C8.1 C9.1 C10.1 C11.1 C12.1 C13.1 C14.1 C15.1 C16.1 C17.1 C22.1 C23.1 C26.1 C33.1 C35.1 LED1.2 NOREF#2.52 NOREF#10.77 NOREF#13.2 NOREF#14.73 NOREF#17.9 NOREF#20.7 NOREF#35.34 NOREF#36.78 NOREF#38.76 R20.2 U1.19 U1.57 U2.4 U3.1 U5.1 U5.10 U5.12 U10.1 USB1.5 USB1.6 X2.2 X2.4
VBUS: C1.2 C3.2 NOREF#7.71 NOREF#16.72 NOREF#28.98 R21.2 U3.3 USB1.1
ADC0: NOREF#4.11 U1.38
ADC1: NOREF#12.10 U1.39
ADC2: NOREF#41.9 U1.40
ADC_AVDD: C9.2 R8.1 U1.43
BATT_V: C33.2 R20.1 R21.1 U1.41
BOOTSEL: NOREF#5.17 R17.2
GPIO7: NOREF#24.45 U1.9
GPIO10: NOREF#29.31 U1.13
GPIO11: NOREF#3.18 U1.14
GPIO14: NOREF#40.17 U1.17
GPIO18: NOREF#39.16 U1.29
GPIO19: NOREF#25.15 U1.30
GPIO20: NOREF#15.14 U1.31
GPIO21: NOREF#9.13 U1.32
GPIO22: NOREF#27.12 U1.34
GPS_1PPS: U1.28 U5.4
GPS_3V3: C22.2 Q2.3 U5.8
GPS_ANT: NOREF#6.4 U5.11
GPS_NRESET: U1.7 U5.9
GPS_ON: U1.8 U5.5
GPS_VCC_ON_N: Q2.1 R14.1 U1.27
I2C0_SCL: U1.16
I2C0_SDA: U1.15
I2C1_SCL: U1.5
I2C1_SDA: U1.4
LED: R18.2 U1.37
NRESET: U1.26 U10.2
PS: U1.35
QSPI_SCLK: U1.52 U2.6
QSPI_SD0: U1.53 U2.5
QSPI_SD1: U1.55 U2.2
QSPI_SD2: U1.54 U2.3
QSPI_SD3: U1.51 U2.7
QSPI_SS: R16.1 R17.1 U1.56 U2.1
RFGND: NOREF#18.1 NOREF#23.5 NOREF#33.2
SWCLK: U1.24
SWD: U1.25
UART0_RX: NOREF#37.2 U1.3
UART0_TX: NOREF#21.1 U1.2
UART1_RX: U1.12 U5.2
UART1_TX: U1.11 U5.3
USB_DM: NOREF.74 R7.2 USB1.2
USB_DP: NOREF#11.75 R6.2 USB1.3
VFO_CLK2: U1.18
VFO_VDD_ON_N: U1.6
XIN: C5.2 U1.20 X2.1
XOUT: R1.2 U1.21
$1N22007: R7.1 U1.46
$1N22362: R6.1 U1.47
$1N70752: C6.2 R1.1 X2.3
$1N107124: LED1.1 R18.1
$1N115739: C35.2 R10.1 U10.3

Pads without a net: NOREF#8 0; NOREF#19 0; NOREF#22 1; NOREF#26 0; NOREF#30 3; NOREF#31 0; NOREF#32 0; U2 9; U5 7 13 14 15 16 17 18; USB1 4

## Via types
v1: diameter 0.508, hole 0.3, Top Layer to Bottom Layer, 119 vias

## Routing (per net, layer and track width the routed paths; a pad name or vN(x,y) marks a point on that pad's centre or on a via; arc(x,y) is an arc through that point)
1V1: length 16
  Top Layer w0.2: 17,21.08 U1.45 17,19.03 16.64,18.67 15.71,18.67 C8.2 ; 17.53,29.54 17.53,29.08 18.2,28.41 U1.23 ; C11.2 19.81,17.78 19,18.6 U1.50
  Bottom Layer w0.2: v1(19,21.67) 19,18.59 v1(19.13,18.46) ; v1(18.08,28.41) 18.2,28.29 v1(18.2,25.58)
3V3: length 101.5
  Top Layer w0.15: R14.2 8.05,35.93 8.44,36.32 ; C15.2 14.11,24.26 14.48,24.62 U1.33 ; 22.35,21.02 23.34,21.02 C12.2
  Top Layer w0.2: 28.07,31.72 28.1,31.75 ; C16.2 13.62,21.02 16.17,21.02 ; C7.2 14.41,19.02 16.45,19.02 16.6,19.17 U1.44 16.6,21.02 ; 18.6,17.38 U1.49 18.6,21.02 ; 18.6,17.38 18.2,17.78 U1.48 18.2,21.02 ; 18.6,17.38 C17.2 ; 11.55,37.02 11.55,36.15 12.01,35.69 ; 16.17,21.02 v1(16.22,21.07) ; 16.17,21.02 16.22,21.02 ; 18.6,26.23 U1.22 18.6,29.48 C14.2 18.67,29.68 ; U1.36 16.19,23.42 ; 21.4,24.62 U1.10 24.11,24.62 24.38,24.89 25.11,24.89 C13.2 ; 22.35,21.02 21.4,21.02 ; v1(9.27,37.21) 7.37,37.21 6.6,37.97 6.6,39.12 8.25,40.77 8.89,40.77 9.68,41.56 U5.6 ; U1.33 16.19,24.62
  Top Layer w0.25: U2.8 22.97,13.26 C23.2
  Top Layer w0.254: C4.2 11.91,16.7 ; C4.2 11.88,16.16 11.88,15.59 ; C4.2 12.76,16.19 ; C2.2 11.88,15.59 ; C2.2 12.7,14.8 ; C2.2 12.09,14.58 U3.2 ; 11.88,15.59 12.67,15.59 12.7,15.62
  Top Layer w0.3: v1(14.35,28.32) R10.2 ; C23.2 C26.2 R16.2 ; 26.8,31.75 26.8,30.99 27.43,30.99 ; 27.95,32.86 27.95,32.38 28.07,32.26 28.07,31.78 28.1,31.75 ; 27.43,30.99 28.07,30.99 28.07,31.72 ; 27.43,30.99 27.45,30.97 27.45,29.73 27.43,29.72 27.18,29.72 26.94,29.48 26.94,29.12 ; v1(15.26,20.44) 15.49,20.44 16.07,21.02
  Top Layer w0.4: v1(27.94,17.27) v1(27.94,18.03) 27.94,27.69 26.94,28.69 26.94,29.12 ; R8.2 11.3,17.21 11.75,16.76
  Top Layer w0.5: 11.55,37.02 10.47,37.02 10.41,37.08 ; 9.27,36.32 9.26,36.32 8.44,36.32
  Bottom Layer w0.3: v1(14.35,28.32) 14.1,28.07 14.1,20.83
  Bottom Layer w0.4: v1(27.94,17.27) v1(25.02,17.27) v1(24.51,17.78)
  Bottom Layer w0.5: NOREF#34.60 2.92,44.83 2.92,40.64 3.3,40.26 7.11,40.26 8.64,38.74 8.64,37.85 v1(9.27,37.21) v1(9.98,37.21)
  vias: v1(12.19,29.59) v1(12.19,28.6) v1(12.19,20.47) v1(12.83,29.59) v1(12.83,28.6) v1(12.83,20.47) v1(13.47,29.59) v1(13.47,28.6) v1(13.47,20.47) v1(14.49,20.44) v1(16.43,21.64)
GND: length 15.3
  Top Layer w0.15: v1(19.94,28.32) 19.8,28.18 U1.19 ; C13.1 26.45,24.98 v1(26.33,25.09) 26.16,25.27 25.78,25.27
  Top Layer w0.2: v1(9.65,38.2) C22.1 ; 28.68,28.51 28.68,30.29 28.66,30.32 28.09,30.32 ; 26.16,32.51 26.16,31.77 26.15,31.75
  Top Layer w0.254: C10.1 C14.1
  Top Layer w0.3: 28.1,30.3 28.1,29.75 28.07,29.72 28.07,29.16 28.03,29.12 ; 26.86,32.86 26.86,32.58 27.08,32.35 27.34,32.35 27.45,32.24 27.45,31.75 ; v1(21.72,16.64) 21.47,16.88 U2.4
  Top Layer w0.5: v1(19.86,30.4) X2.4 ; 10.29,16.76 10.67,16.76 10.82,16.61 C4.1 10.92,16.09 v1(10.92,15.62) 10.92,15.24 C2.1 11.05,14.22 11.05,14.22
  vias: v1(3.3,23.37) v1(3.3,20.83) v1(3.68,54.74) v1(3.68,50.42) v1(3.68,47.93) v1(3.68,44.96) v1(4.32,17.91) v1(4.32,16.15) v1(4.32,14.34) v1(4.7,27.18) v1(5.59,19.3) v1(5.84,54.74) v1(6.22,50.42) v1(7.37,27.18) v1(7.49,14.86) v1(7.92,54.74) v1(8.48,50.42) v1(9.11,20.57) v1(9.11,18.65) v1(9.11,16.93) v1(9.91,27.18) v1(10.67,50.42) v1(11.13,13.95) v1(11.24,24.31) v1(11.18,20.57) v1(11.22,12.32) v1(11.16,10.69) v1(12.94,10.68) v1(12.96,11.93) v1(13.1,50.42) v1(13.59,47.93) v1(13.59,44.96) v1(14.13,31.43) v1(14.22,16.26) v1(14.54,31.88) v1(15.19,15.9) v1(16.51,31.75) v1(17.15,33.27) v1(17.4,32.51) v1(17.53,31.62) v1(17.56,24.86) v1(17.56,23.62) v1(17.56,22.38) v1(17.87,33.27) v1(18.21,32.51) v1(18.41,31.62) v1(18.54,33.27) v1(18.67,15.11) v1(18.8,24.86) v1(18.8,23.62) v1(18.8,22.38) v1(19.81,15.11) v1(20,31.44) v1(20.04,24.86) v1(20.04,23.62) v1(20.04,22.38) v1(21.59,31.5) v1(22.11,26.76) v1(22.1,12.19) v1(22.48,31.62) v1(22.48,16.64)
VBUS: length 26.5
  Top Layer w0.15: 7.94,17.22 7.94,16.57 v1(7.87,16.51)
  Top Layer w0.4: USB1.1 14.77,3.09 14.6,2.92
  Top Layer w1: 9.4,4.45 6.86,4.45 NOREF#7.71 7.37,8.13 7.37,8.89 ; 9.4,4.45 9.4,9.14 ; 9.4,4.45 14.6,2.29 14.6,2.92
  Bottom Layer w0.15: NOREF#28.98 8.25,16.13 v1(7.87,16.51)
ADC0: length 15.7
  Top Layer w0.15: U1.38 14.41,22.62 14.28,22.75 10.98,22.75 10.42,22.2 5.94,22.2 1.65,17.91
ADC1: length 17.7
  Top Layer w0.15: U1.39 14.38,22.22 14.16,22.45 11.1,22.45 10.55,21.89 6.27,21.89 2.79,18.42 2.79,16.51 1.65,15.37
ADC2: length 19.8
  Top Layer w0.15: 1.65,12.83 2.79,13.97 2.79,15.88 3.3,16.38 3.3,18.29 6.6,21.59 10.67,21.59 11.23,22.15 14.03,22.15 14.36,21.82 U1.40
ADC_AVDD: length 7.1
  Top Layer w0.2: C9.2 11.19,18.58 R8.1
  Top Layer w0.4: R8.1 11.31,18.47 v1(11.31,19.56)
  Bottom Layer w0.4: v1(16.08,19.56) v1(11.31,19.56)
BATT_V: length 10.6
  Top Layer w0.15: U1.41 14.33,21.42 13.91,21.84 11.35,21.84 10.8,21.29 8.45,21.29 R20.1 7.93,19.45 C33.2 7.94,19.4 R21.1
BOOTSEL: length 8.2
  Top Layer w0.15: R17.2 24.64,9.09 NOREF#5.17 24.64,1.78 24.76,1.65
GPIO7: length 46.3
  Top Layer w0.15: v1(24.51,24.13) 24.42,24.22 U1.9 ; v1(3.43,38.35) v1(4.95,38.35)
  Bottom Layer w0.15: v1(4.95,38.35) 4.95,34.93 5.46,34.42 14.86,34.42 16.08,35.64 25.36,35.64 27.29,33.71 27.29,25 26.67,24.38 24.76,24.38 v1(24.51,24.13) ; 1.65,41.02 1.91,40.77 1.91,40.26 3.43,38.74 v1(3.43,38.35)
GPIO10: length 40.6
  Top Layer w0.15: U1.13 23.03,25.82 23.68,26.47 v1(23.97,26.47)
  Bottom Layer w0.15: NOREF#29.31 3.3,36.83 3.3,34.54 4.57,33.27 15.11,33.27 16.51,34.67 25.04,34.67 26.37,33.35 26.37,26.67 25.91,26.21 24.22,26.21 v1(23.97,26.47)
GPIO11: length 33.7
  Top Layer w0.15: U1.14 22.94,26.82 v1(23.25,26.82)
  Bottom Layer w0.15: v1(23.25,26.82) 24.36,27.92 24.36,33.81 23.88,34.29 16.64,34.29 15.24,32.89 4.06,32.89 1.65,35.31 NOREF#3.18
GPIO14: length 31.1
  Top Layer w0.15: v1(22.99,28.58) 21.38,28.58 20.59,27.78 20.59,27.19
  Bottom Layer w0.15: NOREF#40.17 2.59,32.46 15.24,32.46 16.68,33.91 22.61,33.91 22.99,33.53 22.99,32.16 23.45,31.7 23.45,29.03 v1(22.99,28.58)
GPIO18: length 17
  Top Layer w0.15: NOREF#39.16 2.79,29.72 2.79,27.18 3.75,26.22 U1.29
GPIO19: length 14.9
  Top Layer w0.15: NOREF#25.15 1.65,27.81 3.64,25.82 U1.30
GPIO20: length 13.7
  Top Layer w0.15: U1.31 2.01,25.42 NOREF#15.14
GPIO21: length 14.3
  Top Layer w0.15: NOREF#9.13 3.43,25.02 11.68,25.02 11.69,25.02 15.25,25.02
GPIO22: length 15.3
  Top Layer w0.15: U1.34 14.57,24.22 13.97,23.62 8.89,23.62 8.64,23.88 5.21,23.88 2.03,20.7 NOREF#27.12
GPS_1PPS: length 22.8
  Top Layer w0.15: U5.4 7.48,41.39 5.59,39.5 5.59,35.9 11.05,30.44 11.05,28.07 11.94,27.18 16.19,27.18 U1.28
GPS_3V3: length 6.7
  Top Layer w0.4: 9.62,39.88 8.25,39.88 7.49,39.12 Q2.3 ; C22.2 10.57,40.84 10.57,40.89 11.43,40.89 11.88,41.35 U5.8
GPS_NRESET: length 42.7
  Top Layer w0.15: v1(12.7,40.26) 12.98,40.54 U5.9 ; v1(25.91,23.5) 25.69,23.27 23.1,23.27 22.95,23.42 U1.7
  Bottom Layer w0.15: v1(12.7,40.26) 11.81,40.26 10.54,38.99 10.54,35.94 11.43,35.05 14.48,35.05 15.7,36.27 25.58,36.27 27.89,33.96 27.89,24.34 27.18,23.62 26.03,23.62 v1(25.91,23.5)
GPS_ON: length 46.7
  Top Layer w0.15: U1.8 23.17,23.82 23.36,23.63 25.04,23.63 v1(25.22,23.82) ; U5.5 8.58,41.35 8.51,41.28 8,41.28 6.1,39.37 6.1,37.59 v1(6.22,37.47)
  Bottom Layer w0.15: v1(6.22,37.47) 5.84,37.08 5.84,35.31 6.4,34.75 14.68,34.75 15.88,35.94 25.48,35.94 27.59,33.84 27.59,24.67 26.92,24 25.41,24 v1(25.22,23.82)
GPS_VCC_ON_N: length 16.5
  Top Layer w0.15: Q2.1 7.19,35.67 R14.1 7.19,35.17 11.56,30.8 11.56,28.19 12.06,27.69 15.37,27.69 15.88,28.19 16.26,28.19 16.6,27.85 U1.27
I2C0_SCL: length 7.9
  Top Layer w0.15: v1(22.48,27.94) 22.47,27.95 21.19,27.95 21,27.76 U1.16
  Bottom Layer w0.15: v1(22.48,27.94) 23.37,27.94 23.75,28.32 23.75,32.26 v1(23.5,32.51)
I2C0_SDA: length 8.4
  Top Layer w0.15: v1(21.97,27.43) 21.71,27.17 U1.15
  Bottom Layer w0.15: v1(21.97,27.43) 23.37,27.43 24.05,28.12 24.05,33.23 v1(23.88,33.4)
I2C1_SCL: length 16.2
  Top Layer w0.15: 26.67,27.31 26.64,27.28 25.51,27.28 25.3,27.07 ; 25.3,27.07 25.3,26.6 26.32,25.58 26.7,25.58 27.13,25.15 27.13,22.81 26.94,22.62 U1.5 ; 25.3,27.07 25.26,27.11 24.94,27.11 24.65,27.39 24.65,27.79 24.94,28.08 25.57,28.08 26.01,28.52 26.01,29.82 26.15,29.96 26.15,30.3
I2C1_SDA: length 15
  Top Layer w0.15: 26.8,30.3 26.8,29.97 26.31,29.49 26.31,28.4 25.6,27.69 25.23,27.69 v1(25.14,27.59) ; v1(25.78,26.8) 26.42,26.16 26.67,26.16 26.67,26.04 27.43,25.27 27.43,22.48 27.18,22.22 U1.4
  Bottom Layer w0.15: v1(25.78,26.8) 25.78,26.95 v1(25.14,27.59)
LED: length 5.1
  Top Layer w0.15: R18.2 10.54,22.86 10.73,23.05 14.41,23.05 14.42,23.02 15.25,23.02
NRESET: length 6.7
  Top Layer w0.15: U1.26 17,27.94 15.37,29.57 15.37,30.73 15.75,31.12 15.75,32.39 16.19,32.83
QSPI_SCLK: length 7.9
  Top Layer w0.15: U2.6 21.97,14.1 21.84,13.97 21.24,13.97 20.78,14.43 20.78,18.08 19.8,19.07 U1.52
QSPI_SD0: length 6.1
  Top Layer w0.15: U2.5 21.47,14.85 21.08,15.24 21.08,18.29 20.2,19.17 U1.53
QSPI_SD1: length 3.2
  Top Layer w0.15: U1.55 21,19.39 22.48,17.91 22.48,17.51 U2.2
QSPI_SD2: length 3.1
  Top Layer w0.15: U1.54 20.6,19.28 21.97,17.91 21.97,17.51 U2.3
QSPI_SD3: length 9.1
  Top Layer w0.15: U2.7 22.48,14.49 22.48,14.1 22.05,13.66 21.01,13.66 20.45,14.22 20.45,17.91 19.4,18.96 U1.51
QSPI_SS: length 12.3
  Top Layer w0.15: 22.99,17.52 22.99,17.53 23.24,17.53 24.13,16.64 R16.1 23.93,16.44 23.5,16 23.5,15.62 v1(23.24,15.37) ; 22.99,17.52 22.99,17.91 21.4,19.5 U1.56 ; 22.99,17.52 U2.1 ; 25.15,10.47 25.27,10.59 v1(25.27,11.3)
  Bottom Layer w0.15: v1(25.27,11.3) 25.27,13.34 v1(23.24,15.37)
RFGND: length 36.3
  Bottom Layer w0.3: NOREF#33.2 28.63,35.1 28.63,9.02 24.38,9.02 NOREF#18.1 NOREF#23.5
SWCLK: length 4.2
  Top Layer w0.15: U1.24 17.8,28 16.51,29.28 v1(16.51,30.86)
SWD: length 3.8
  Top Layer w0.15: U1.25 17.4,27.97 15.88,29.49 v1(15.88,30.35)
UART0_RX: length 10.8
  Top Layer w0.15: 27.31,15.49 26.54,16.26 26.54,21.82 U1.3
UART0_TX: length 12.8
  Top Layer w0.15: NOREF#21.1 26.16,14.1 26.16,21.42 U1.2
UART1_RX: length 44.1
  Top Layer w0.15: U5.2 5.21,42.18 5.21,40.89 3.94,39.62 v1(3.94,39.37) ; U1.12 23.35,25.42 v1(23.63,25.7)
  Bottom Layer w0.15: v1(23.63,25.7) 23.84,25.91 26.03,25.91 26.67,26.54 26.67,33.47 25.14,35 16.38,35 15.03,33.66 5.08,33.66 3.94,34.8 v1(3.94,39.37)
UART1_TX: length 44.8
  Top Layer w0.15: U5.3 6.38,40.93 v1(4.83,39.37) ; 22.35,25.02 23.52,25.02 23.64,25.14 23.99,25.14 v1(24.26,25.4)
  Bottom Layer w0.15: v1(4.83,39.37) 4.32,38.86 4.32,35.05 5.33,34.04 14.99,34.04 16.26,35.31 25.26,35.31 26.98,33.59 26.98,26.43 25.96,25.4 v1(24.26,25.4)
USB_DM: length 13.4
  Top Layer w0.3: R7.2 16.51,16.84 16.51,16.26
  Top Layer w0.4: USB1.2 15.42,5.33 15.28,5.47
  Top Layer w0.8: 16.51,16.26 16.51,10.41 15.28,9.19 15.28,5.47
USB_DP: length 13.4
  Top Layer w0.3: 17.46,16.26 17.46,16.9 R6.2
  Top Layer w0.4: USB1.3 16.07,5.3 16.23,5.47
  Top Layer w0.8: 16.23,5.47 16.23,8.74 17.46,9.97 17.46,16.26
VFO_VDD_ON_N: length 4.3
  Top Layer w0.15: 22.35,23.02 22.42,22.95 26.38,22.95 v1(26.54,23.11)
XIN: length 6.7
  Top Layer w0.15: C5.2 23.84,30.44 22.51,30.44 X2.1 21.53,29.46 20.32,29.46 19.4,28.54 U1.20
XOUT: length 5
  Top Layer w0.15: 19.3,32.08 19.3,29.08 19,28.78 U1.21
$1N22007: length 2.7
  Top Layer w0.2: R7.1 16.38,17.91 17.4,18.92 U1.46
$1N22362: length 2.4
  Top Layer w0.2: R6.1 17.53,18.54 17.8,18.81 U1.47
$1N70752: length 2.4
  Top Layer w0.15: 19.34,33.69 19.3,33.66 R1.1 20.49,32.82 20.72,32.6
$1N107124: length 1.7
  Top Layer w0.15: LED1.1 8.51,23.11 8.76,22.86 R18.1
$1N115739: length 6.9
  Top Layer w0.3: 16.34,35.31 16.29,35.36 15.34,35.36 15.24,35.26 15.24,31.37 14.86,30.99 14.86,30.41 R10.1

## Copper pours and planes (outline as drawn; the poured copper is in the pictures)
1V1 on Top Layer: 16.89,25.81 20.99,25.81 20.99,20.78 16.89,20.78
3V3 on Top Layer: 11.94,19.37 13.46,19.37 13.46,16.96 11.94,16.96
3V3 on Top Layer: 8.99,37.49 13.72,37.49 13.72,28.32 8.99,28.32
3V3 on Top Layer: 11.94,17.02 13.46,17.02 13.46,12.45 11.94,12.45
3V3 on Top Layer: 21.67,20.83 25.27,20.83 25.27,14.73 21.67,14.73
3V3 on Top Layer: 11.94,20.76 15.65,20.76 15.65,19.3 11.94,19.3
3V3 on Top Layer: 23.33,14.86 25.27,14.86 25.27,13.87 23.33,13.87
3V3 on Top Layer: 15.96,26.47 21.63,26.47 21.63,20.77 15.96,20.77
3V3 on Bottom Layer: 13.69,22.08 16.7,22.08 16.7,20.07 13.69,20.07
3V3 on Bottom Layer: 11.94,29.85 13.72,29.85 13.72,20.07 11.94,20.07
GND on Top Layer: 15.11,36.96 18.29,36.96 18.29,36.07 15.11,36.07
GND on Top Layer: 0,36.45 28.96,36.45 28.96,0 0,0
GND on Top Layer: 2.79,55.19 3.43,55.19 3.43,52.2 2.79,52.2
GND on Top Layer: 3.3,55.5 13.84,55.5 13.84,40.89 3.3,40.89
GND on Top Layer: 0,55.5 2.92,55.5 2.92,33.15 0,33.15
GND on Bottom Layer: 3.3,55.5 13.84,55.5 13.84,37.85 3.3,37.85
GND on Bottom Layer: 0,36.45 28.96,36.45 28.96,-0.13 0,-0.13
GND on Bottom Layer: 0,55.5 2.92,55.5 2.92,33.27 0,33.27
GND on Bottom Layer: 2.79,55.19 3.43,55.19 3.43,52.2 2.79,52.2
VBUS on Top Layer: 6.86,8.76 10.62,8.76 10.62,14.07 6.86,14.07

Small or netless copper shapes (teardrops, artwork), in the pictures only: 2 on Top Layer

## Text on the board
Bottom Silkscreen Layer: BOOTSEL | POWER | RF / GND | GND | 3V3 | - | GPIO7 | GPIO10 | GPIO11 | GPIO14 | GPIO18 | GPIO21 | + | GPIO22 | GPIO19 RF | GPIO20 RF | GPIO27 ADC1 | GPIO28 ADC2 | GPIO26 ADC0 | ANT GND / GPS | USB | D+ D- | OUT | IN | short for / RF GND
Top Silkscreen Layer: JLCJLCJLCJLC | RF / GND | 3V3 | RF1 | RF2 | KC3LBR / RP2040 / pico-WSPRer / gen2 v0.1
